# EAGLE design MRA10 (EAGLE 5.11)
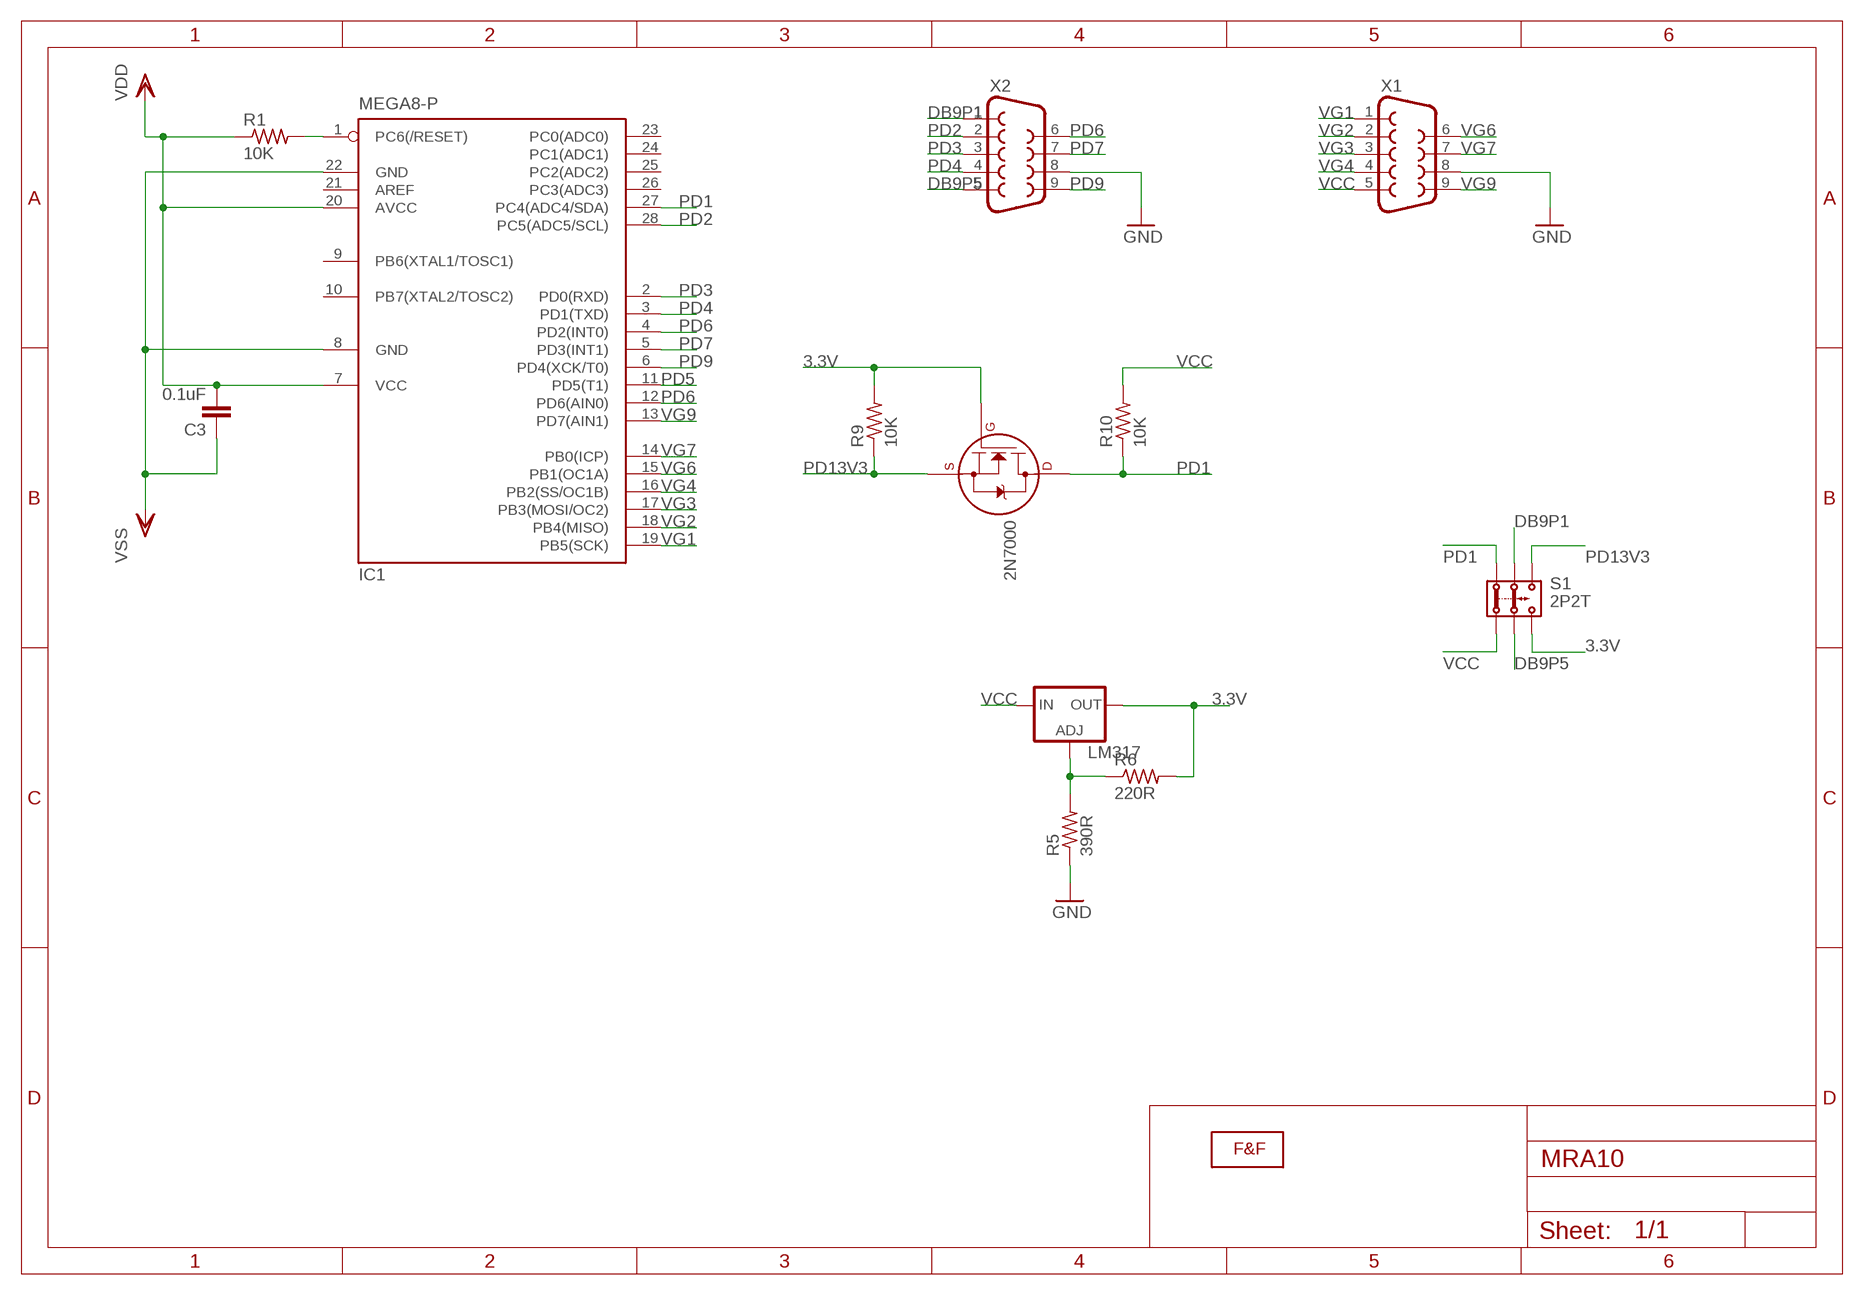
[diagram p0: schematic, sheet 1]

## Parts
2N7000  2N7000_TO92  [TO-92]
C3  0.1uF  C-EU050-024X044  [C050-024X044]
IC1  MEGA8-P  [DIL28-3]
LM317  LM317TS  [317TS]
R1  10K  R-US_0207/10  [0207/10]
R5  390R  R-US_0207/10  [0207/10]
R6  220R  R-US_0207/10  [0207/10]
R9  10K  R-US_0207/10  [0207/10]
R10  10K  R-US_0207/10  [0207/10]
S1  2P2T  [2P2T]
U$1  LOGOLOGO_WITHOUT_SMOKE_SMALL  [LOGO2_SMALL]
X1  DB9MALE  [DB9_MALE]
X2  DB9MALE  [DB9_MALE]

## Nets
3.3V: 2N7000.2(G) LM317.2(OUT) R6.2 R9.2 S1.3.2
DB9P1: S1.2.1 X2.1
DB9P5: S1.2.2 X2.5
GND: C3.1 IC1.8(GND) IC1.22(GND) R5.1 X1.8 X2.8 ; supply symbol labelled VSS
N$1: IC1.1(PC6(/RESET)) R1.2
N$5: LM317.1(ADJ) R5.2 R6.1
PD1: 2N7000.3(D) IC1.27(PC4(ADC4/SDA)) R10.1 S1.1.1
PD2: IC1.28(PC5(ADC5/SCL)) X2.2
PD3: IC1.2(PD0(RXD)) X2.3
PD4: IC1.3(PD1(TXD)) X2.4
PD5: IC1.11(PD5(T1))
PD6: IC1.4(PD2(INT0)) IC1.12(PD6(AIN0)) X2.6
PD7: IC1.5(PD3(INT1)) X2.7
PD9: IC1.6(PD4(XCK/T0)) X2.9
PD13V3: 2N7000.1(S) R9.1 S1.3.1
VCC: C3.2 IC1.7(VCC) IC1.20(AVCC) LM317.3(IN) R1.1 R10.2 S1.1.2 X1.5 ; supply symbol labelled VDD
VG1: IC1.19(PB5(SCK)) X1.1
VG2: IC1.18(PB4(MISO)) X1.2
VG3: IC1.17(PB3(MOSI/OC2)) X1.3
VG4: IC1.16(PB2(SS/OC1B)) X1.4
VG6: IC1.15(PB1(OC1A)) X1.6
VG7: IC1.14(PB0(ICP)) X1.7
VG9: IC1.13(PD7(AIN1)) X1.9
Unconnected: IC1.9(PB6(XTAL1/TOSC1)) IC1.10(PB7(XTAL2/TOSC2)) IC1.21(AREF) IC1.23(PC0(ADC0)) IC1.24(PC1(ADC1)) IC1.25(PC2(ADC2)) IC1.26(PC3(ADC3))

## Library data of the parts
2N7000 = transistors:2N700*: 2N7000, 2N7002, NDS7002A N-channel enhancement mode MOSFET
C3 = rcl:C-EU: CAPACITOR, European symbol
IC1 = atmel:MEGA8-P: MICROCONTROLLER 8 Kbytes FLASH, 1 kbytes SRAM, 512 bytes EEPROM, USART, 4-channel 10 bit ADC, 2-channel 8 bit ADC Pin compatible with Atmega48, ATMega88, ATMega168 Source: avr.lbr; OC_FARNELL: unknown; OC_NEWARK: unknown
LM317 = v-reg:LM317TS: VOLTAGE REGULATOR
R1 R5 R6 R9 R10 = adafruit:R-US_: RESISTOR, American symbol
S1 = Itead_BP_110825:2P2T: BAS011
U$1 = F&F:LOGO: Faísca e Fumaça Logo faiscaefumaca.com.br
X1 X2 = SparkFun:DB9: DB9 Connector Standard DB9 (D-Sub 9) serial connector. Can be used for CAN bus as well as RS485 and RS232. Footprint production proven. Spark Fun Electronics SKU : PRT-00429

## Board
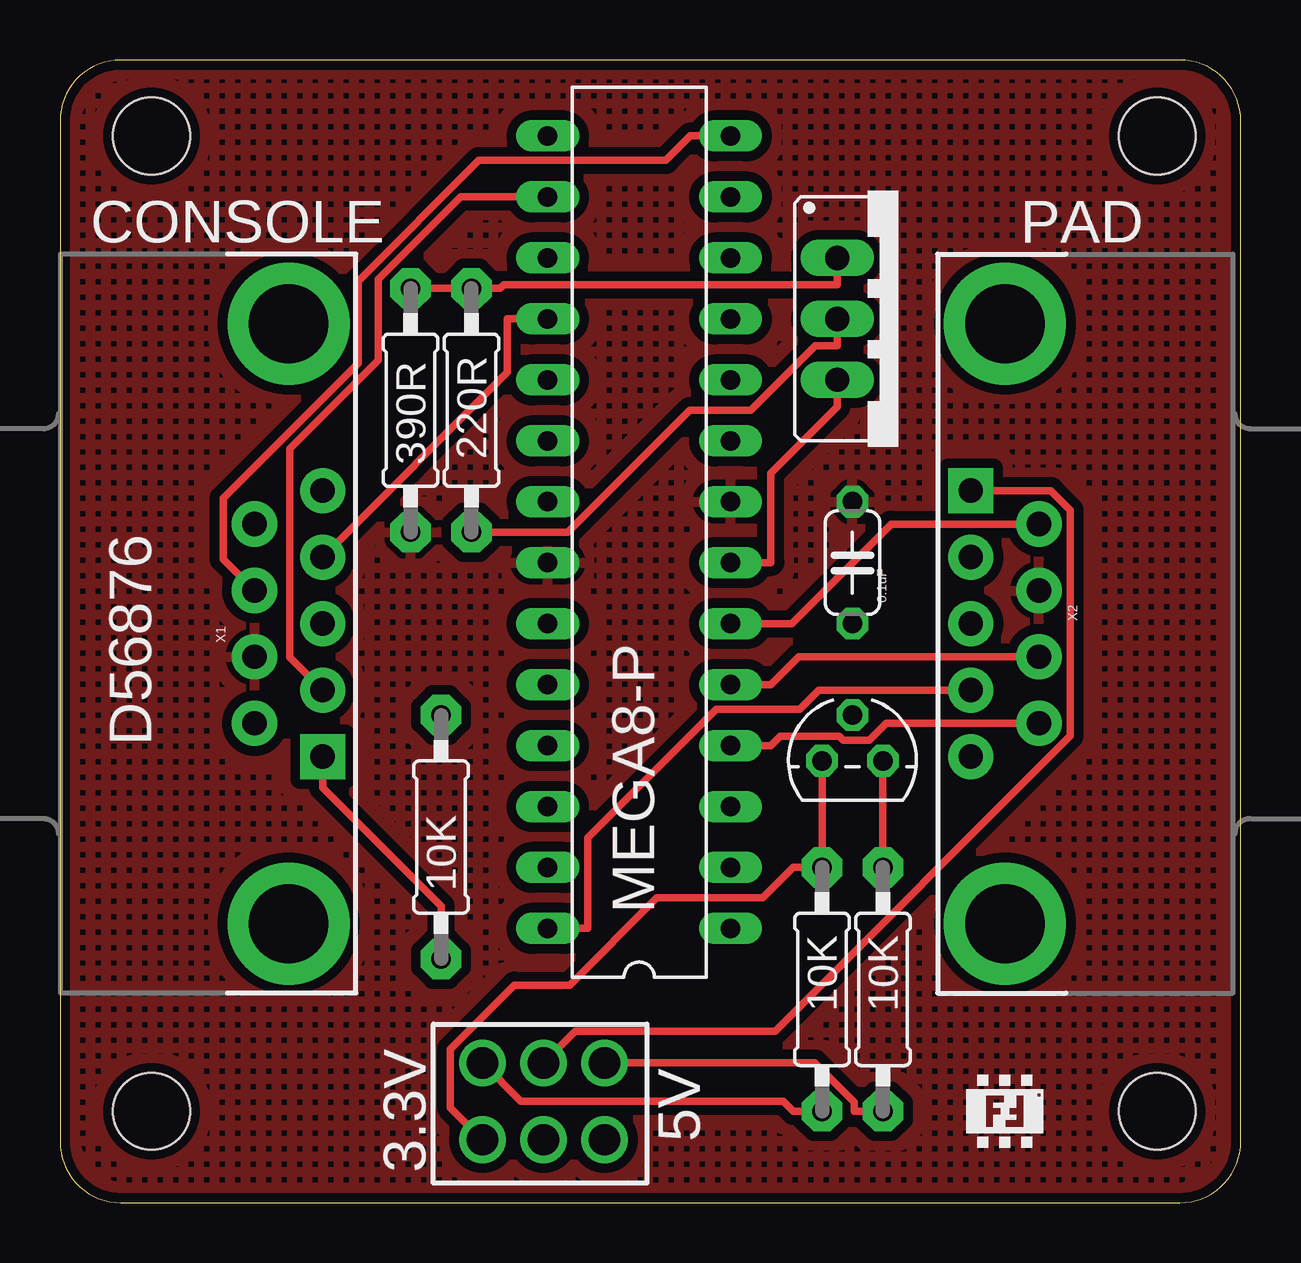
[diagram p1: board, top side]
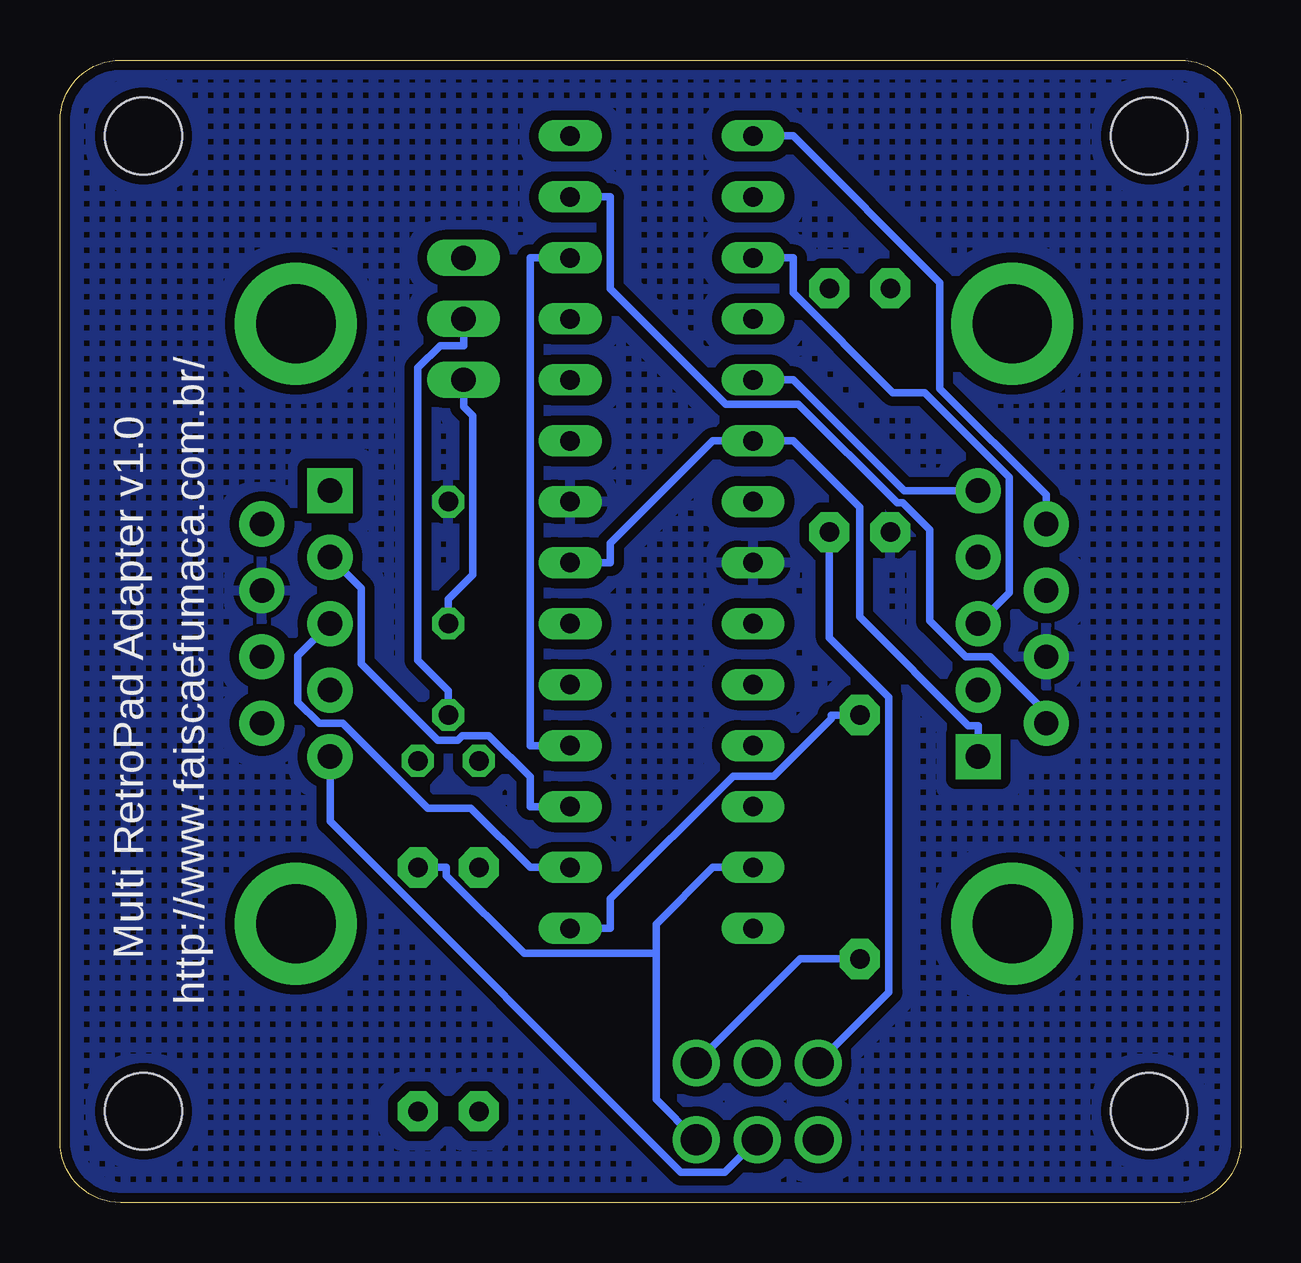
[diagram p2: board, bottom side, seen from below]

Size 49.2 x 47.62 mm. Coordinates in mm from the lower left corner, seen from the top.
Outline: 49.2,45.08 arc90 46.66,47.62 2.54,47.62 arc90 0,45.08 0,2.54 arc90 2.54,0 46.66,0 arc90 49.2,2.54 49.2,45.08
Copper layers (1*16): Top 0.035mm / dielectric 1.5mm / Bottom 0.035mm
Design rules "Fusion_eagle_rule_v1.1": minimum track width 6mil, minimum drill 12mil, track to track 6mil, track to pad 6mil, pad to pad 6mil, via to via 6mil, smd to smd 0mil, copper to edge 10mil, drill to drill 10mil, minimum pad ring 10mil, minimum via ring 6mil, stop-mask expansion 2mil, vias tented up to drill 100mil, thermal gap 10mil
Holes 3.2 mm at 3.81,44.45 3.81,3.81 45.72,44.45 45.72,3.81

### Footprints (pad centres in the part's own frame; a part is rotated, then mirrored left to right if it is on the bottom)
TO-92 = drill 0.813 octagon: 1 -1.27,0; 2 0,1.905; 3 1.27,0
C050-024X044 = drill 0.813 octagon: 1 -2.54,0; 2 2.54,0
DIL28-3 = drill 0.813 long: 1 -16.51,-3.81; 2 -13.97,-3.81; 3 -11.43,-3.81; 4 -8.89,-3.81; 5 -6.35,-3.81; 6 -3.81,-3.81; 7 -1.27,-3.81; 8 1.27,-3.81; 9 3.81,-3.81; 10 6.35,-3.81; 11 8.89,-3.81; 12 11.43,-3.81; 13 13.97,-3.81; 14 16.51,-3.81; 15 16.51,3.81; 16 13.97,3.81; 17 11.43,3.81; 18 8.89,3.81; 19 6.35,3.81; 20 3.81,3.81; 21 1.27,3.81; 22 -1.27,3.81; 23 -3.81,3.81; 24 -6.35,3.81; 25 -8.89,3.81; 26 -11.43,3.81; 27 -13.97,3.81; 28 -16.51,3.81
317TS = drill 1.016 long: 1 -2.54,-2.54; 2 0,-2.54; 3 2.54,-2.54
0207/10 = drill 0.813 pad 1.676 octagon: 1 -5.08,0; 2 5.08,0
2P2T = drill 1.3 pad 1.93 round: 1.1 -3.635,-0.085; 1.2 -3.635,-3.285; 2.1 -1.095,-0.085; 2.2 -1.095,-3.285; 3.1 1.445,-0.085; 3.2 1.445,-3.285
DB9_MALE = drill 1.016 pad 1.88 round: 1 5.54,-1.42; 2 2.77,-1.42; 3 0,-1.42; 4 -2.77,-1.42; 6 4.15,1.42; 7 1.38,1.42; 8 -1.38,1.42; 9 -4.15,1.42 | drill 1.016 pad 1.88 square: 5 -5.54,-1.42 | drill 3.302 pad 5.08 round: G1 -12.5,0; G2 12.5,0

### Placement (x,y rotation side)
2N7000  33.02,18.41 0 top
C3  33.02,26.67 270 top
IC1  24.13,27.94 90 top
LM317  34.92,36.83 270 top
R1  15.88,15.24 90 top
R5  14.61,33.02 90 top
R6  17.14,33.02 270 top
R9  31.75,8.89 270 top
R10  34.29,8.89 270 top
S1  19.05,2.54 180 top
U$1  39.37,3.81 0 top
X1  9.53,24.13 90 top
X2  39.37,24.13 270 top

### Tracks (layer width: path | path; a pad name or v marks a point on that pad's centre or on a via)
3.3V
  Top 0.305: LM317.2 32.38,35.71 31.46,35.71 28.77,33.02 26.24,33.02 21.16,27.94 R6.2 | R9.2 30.56,3.81 30.14,4.22 19.2,4.22 S1.3.2
  Bottom 0.305: S1.3.2 14.66,8.77 14.66,21.06 17.14,23.54 R6.2 | 2N7000.2 33.02,21.34 34.29,22.61 34.29,34.78 33.36,35.71 32.38,35.71 LM317.2
DB9P1
  Bottom 0.305: X2.1 37.95,15.89 23.33,1.27 21.5,1.27 S1.2.1
DB9P5
  Top 0.305: S1.2.2 21.48,7.16 29.8,7.16 42.09,19.45 42.09,28.86 41.28,29.67 X2.5
GND
  pour Bottom (isolate 0.406, hatched): 0,48.26 49.53,48.26 49.53,0 0,0
  pour Top (isolate 0.406, hatched): 0,48.26 49.53,48.26 49.53,0 0,0
N$1
  Bottom 0.305: IC1.1 26.26,11.43 26.26,12.67 21.15,17.78 19.46,17.78 17.07,20.17 17.07,20.32 R1.2
N$5
  Top 0.305: R5.2 R6.1 18.34,38.1 18.49,38.25 32.38,38.25 LM317.1
PD1
  Top 0.305: R10.1 2N7000.3
  Bottom 0.305: 24.36,10.39 24.36,11.6 22,13.97 IC1.27 | S1.1.1 24.36,4.3 24.36,10.39 | 24.36,10.39 29.86,10.39 33.1,13.63 33.1,13.97 R10.1
PD2
  Top 0.305: IC1.28 22,11.43 22,15.21 27.35,20.57 30.81,20.57 31.61,21.36 X2.2
PD3
  Bottom 0.305: IC1.2 29.62,13.97 32.08,16.44 33.88,16.44 37.42,19.98 38.41,19.98 39.29,20.86 39.29,22.79 X2.3
PD4
  Bottom 0.305: IC1.3 29.62,16.51 29.62,17.75 31.33,19.46 32.44,19.46 32.63,19.27 33.46,19.27 36.65,22.47 36.65,25.6 X2.4
PD6
  Top 0.305: IC1.4 29.62,19.05 30,19.43 32.47,19.43 32.63,19.27 33.71,19.27 34.42,19.98 X2.6
  Bottom 0.305: IC1.4 29.62,19.05 29.62,39.37 IC1.12
PD7
  Top 0.305: X2.7 30.78,22.75 29.62,21.59 IC1.5
PD9
  Top 0.305: X2.9 34.63,28.28 30.48,24.13 IC1.6
PD13V3
  Top 0.305: S1.3.1 16.26,3.97 16.26,6.41 18.93,9.07 21.23,9.07 24.86,12.7 29.29,12.7 30.56,13.97 R9.1 2N7000.1
VCC
  Top 0.305: X1.5 10.95,17.29 15.88,12.36 R1.1 | LM317.3 32.38,33.17 29.62,30.4 29.62,26.67 IC1.7 | R10.2 33.1,3.81 33.1,4.18 31.45,5.83 S1.1.2
  Bottom 0.305: R1.1 18.35,10.16 S1.1.2 | X1.5 10.95,19.89 11.35,19.89 15.88,24.41 15.88,28.98 18.64,31.75 IC1.20 22,31.75 26.26,27.48 26.26,26.67 IC1.7 | C3.2 33.02,25.15 32,26.17 32,32.78 32.38,33.17 LM317.3
VG1
  Bottom 0.305: IC1.19 18.64,34.29 14.02,29.67 X1.1
VG2
  Top 0.305: IC1.18 18.64,36.83 18.64,34.6 X1.2
VG3
  Bottom 0.305: IC1.17 18.64,39.37 18.64,37.91 14.49,33.76 13.17,33.76 9.65,30.23 9.65,25.43 X1.3
VG4
  Top 0.305: X1.4 9.58,22.73 9.58,31.41 13.27,35.1 13.27,38.48 16.7,41.91 IC1.16
VG6
  Bottom 0.305: IC1.15 18.64,44.45 12.53,38.34 12.53,33.92 8.11,29.5 X1.6
VG7
  Top 0.305: IC1.14 26.26,44.45 25.25,43.43 17.45,43.43 12.42,38.4 12.42,34.97 6.8,29.35 6.8,26.82 X1.7
VG9
  Bottom 0.305: IC1.13 26.26,41.91 26.26,38.09 21.45,33.27 18.43,33.27 14.32,29.16 14.09,29.16 12.97,28.04 12.97,24.25 11.46,22.75 10.44,22.75 8.11,20.41 X1.9

### Text on the board
tPlace: CONSOLE | PAD | D56876 | 5V | 3.3V
bPlace: Multi RetroPad Adapter v1.0 | http://www.faiscaefumaca.com.br/